# Altium schematic sheet SolBin.SchDoc: Soldeerbout In
size A4; DrawnBy: Mangelschots Emiel; SheetNumber: 2; SheetTotal: 5; Parameter 1: /; Parameter 2: 1EAID 12302093
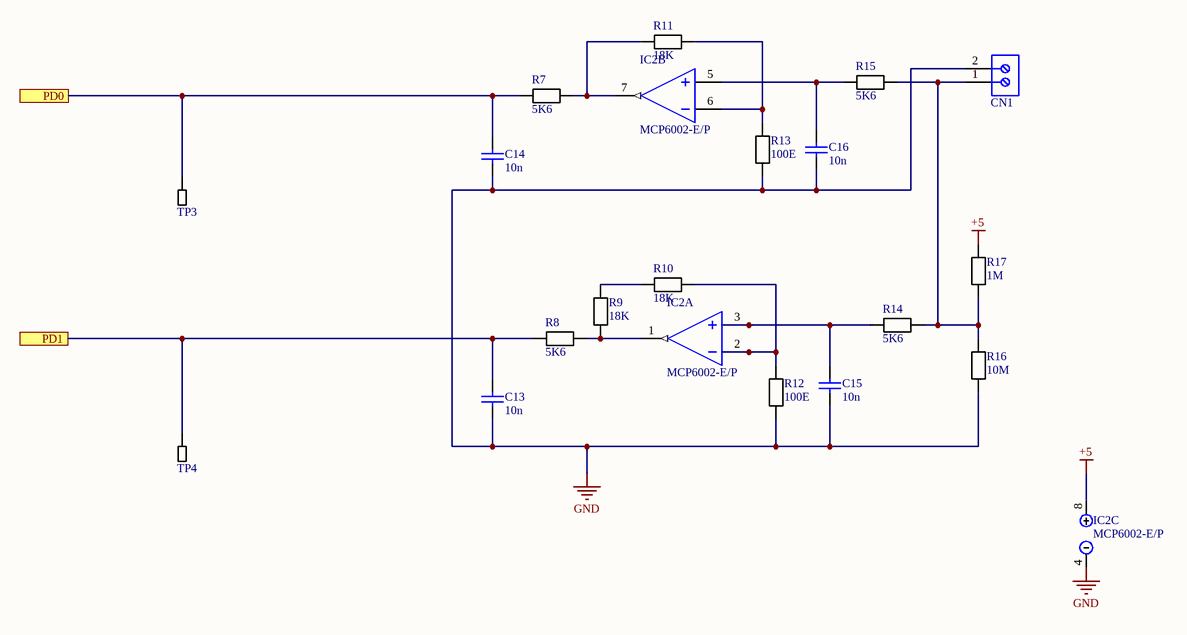
[diagram p0: SolBin.SchDoc]

## Parts
C13  10n  [CAPA]
C14  10n  [CAPA]
C15  10n  [CAPA]
C16  10n  [CAPA]
CN1  1725656  [2 pinHeader]  (value not drawn)
IC2  MCP6002-E/P  [PDIP300-P8]  (parts A,B,C of 3)
R7  5K6  [REST]
R8  5K6  [REST]
R9  18K  [REST]
R10  18K  [REST]
R11  18K  [REST]
R12  100E  [REST]
R13  100E  [REST]
R14  5K6  [REST]
R15  5K6  [REST]
R16  10M  [REST]
R17  1M  [REST]
TP3  TP  [TP]  (value not drawn)
TP4  TP  [TP]  (value not drawn)

## Ports
PD0 (see CPU[4B]), PD1 (see CPU[4B])

## Nets
+5: IC2.8 R17.2
GND: C13.1 C14.1 C15.1 C16.1 CN1.2 IC2.4 R12.1 R13.1 R16.1
PD0: C14.2 R7.1 TP3.1 ; port PD0
PD1: C13.2 R8.1 TP4.1 ; port PD1
NetC15_2: C15.2 IC2.3(VINA+) R14.1
NetC16_2: C16.2 IC2.5(VINB+) R15.1
NetCN1_1: CN1.1 R14.2 R15.2 R16.2 R17.1
NetIC2_1: IC2.1(VOUTA) R8.2 R9.1
NetIC2_2: IC2.2(VINA-) R10.2 R12.2
NetIC2_6: IC2.6(VINB-) R11.2 R13.2
NetIC2_7: IC2.7(VOUTB) R7.2 R11.1
NetR9_2: R9.2 R10.1

## Library data of the parts
C13-C16 = Capasitor: Part Number: GRM1885C1H100JA01D; Manufacturer: Murata
CN1 = 2Pin-Header: Manufacturer: Phoenix Contact; Number of contacts: 2; Content: 250pc(s); Pitch: 2.54mm; Industrial packaging: Yes; Colour: Green; Manufacturer part No.: 1725656; Type: MPT0,5/2-2,54; Datasheet URL: http://datasheet.octopart.com/1725656-Phoenix-Contact-datasheet-5302866.pdf; Manufacturer URL: http://www.phoenixcontact.com/; Datasheet Version: Apr-08
IC2 = CMP-0187-00133-3: Slew Rate: 0.6V/µs; Supply Current: 100uA; Power Supply Rejection Ratio (PSRR): 86dB; Input Offset Voltage (Vos): 4.5mV; Input Bias Current: 1pA; Amplifier Type: GENERAL PURPOSE; Unity Gain Bandwidth Product: 1MHz; Number of Circuits: 2; Output Current: 23mA; Operating Supply Voltage: 5.5V; Min Supply Voltage: 1.8V; Common Mode Rejection Ratio: 60dB; Voltage Gain: 112dB; Max Supply Voltage: 6V; Package Quantity: 60; REACH SVHC: No SVHC; Min Operating Temperature: -40°C; Max Operating Temperature: 125°C; Mount: Through Hole; Nominal Supply Current: 100uA; Height: 3.3mm; Length: 9.27mm; Slew Rate-Nom: 0.6V/µs; Packaging: Rail/Tube; Output Current per Channel: 23mA; Number of Amplifiers: 2; RoHS Compliant: Yes; Radiation Hardening: No; Bandwidth: 1MHz; Lead Free: Lead Free; Width: 6.35mm; Number of Channels: 2; Gain Bandwidth Product: 1MHz; Technology: CMOS; Operating Supply Current: 100uA; Number of Elements: 2; Number of Pins: 8; Input Offset Voltage-Max: 4.5mV; Case/Package: PDIP
R7-R17 = resistor: Manufacturer: Vishay Dale; Part Number: CRCW08050000Z0EA
TP3 TP4 = TP: Part Number: GRM1885C1H100JA01D; Manufacturer: Murata